# Altium project ADAPT-TOR.PrjPcb
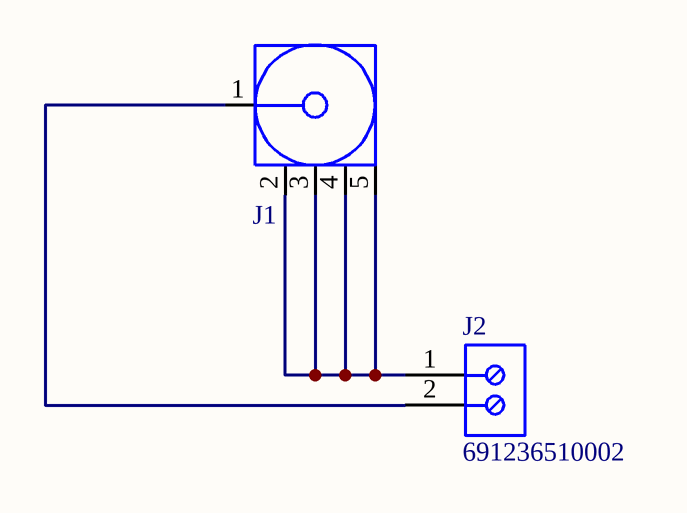
[diagram p0: Pince.SchDoc]
1 sheet, 2 parts. Net scope: global (net labels, ports and power ports of the same name join across sheets).
Board file: Pince-1.PcbDoc

## Sheet Pince.SchDoc
size A3; SheetNumber: 1; SheetTotal: 1

### Parts
J1  60411042241501  [60411042241501]  (value not drawn)
J2  691236510002  [691236510002]

### Nets
NetJ1_1: J1.1(Signal) J2.2
NetJ1_2: J1.2(GND) J1.3(GND) J1.4(GND) J1.5(GND) J2.1

### Library data of the parts
J1 = 60411042241501: WR-NTYPE N Type PCB Connector, Right Angle Jack, DC~4GHz, 50Ohm; Manufacturer: Wurth Elektronik; Center Contact Diameter: 1.6mm; Panel Thickness: 6.5mm; Manufacturer Part Number: 60411042241501; Category: Coaxial Connectors; Match Code: WR-NTYPE; ComponentLink1Description: Website Link; ComponentLink1URL: https://www.we-online.com/redexpert/article/60411042241501?ad; ComponentLink2Description: Datasheet Link; ComponentLink2URL: https://www.we-online.com/redexpert/spec/60411042241501?ad; Mount: Through Hole; Operating Temperature Max: 165°C; Operating Temperature Min: -65°C; Packaging: Tray; Frequency Range: DC~4GHz; Gender: Jack; Impedance: 50Ohm; Orientation: Right Angle
J2 = 691236510002: WR-TBL Serie 2365 Horizontal Entry, Rising Cage Clamp, pitch 5.08mm, 2p; Compliance: Lead free / RoHS; Modularity: Yes; PCB/Cable/Panel: PCB; Pin Number: 2; Rated Current [UL]: 20A; Working Voltage [UL]: 300VAC; ComponentLink1Description: Manufacturer; ComponentLink1URL: http://www.we-online.de; ComponentLink2URL: https://katalog.we-online.de/em/datasheet/691236510002.pdf; ComponentLink2Description: Datasheet; Mounting Technology: THT; Part Number: 691236510002; Packaging: Box; Operating Temperature: -30 to +120degC; Pitch: 5.08mm; Published Date: October 2019; Type: Horizontal; Publisher: Wurth Elektronik; Application: Rising Cage Clamp